# Altium project stm32_board.PrjPcb
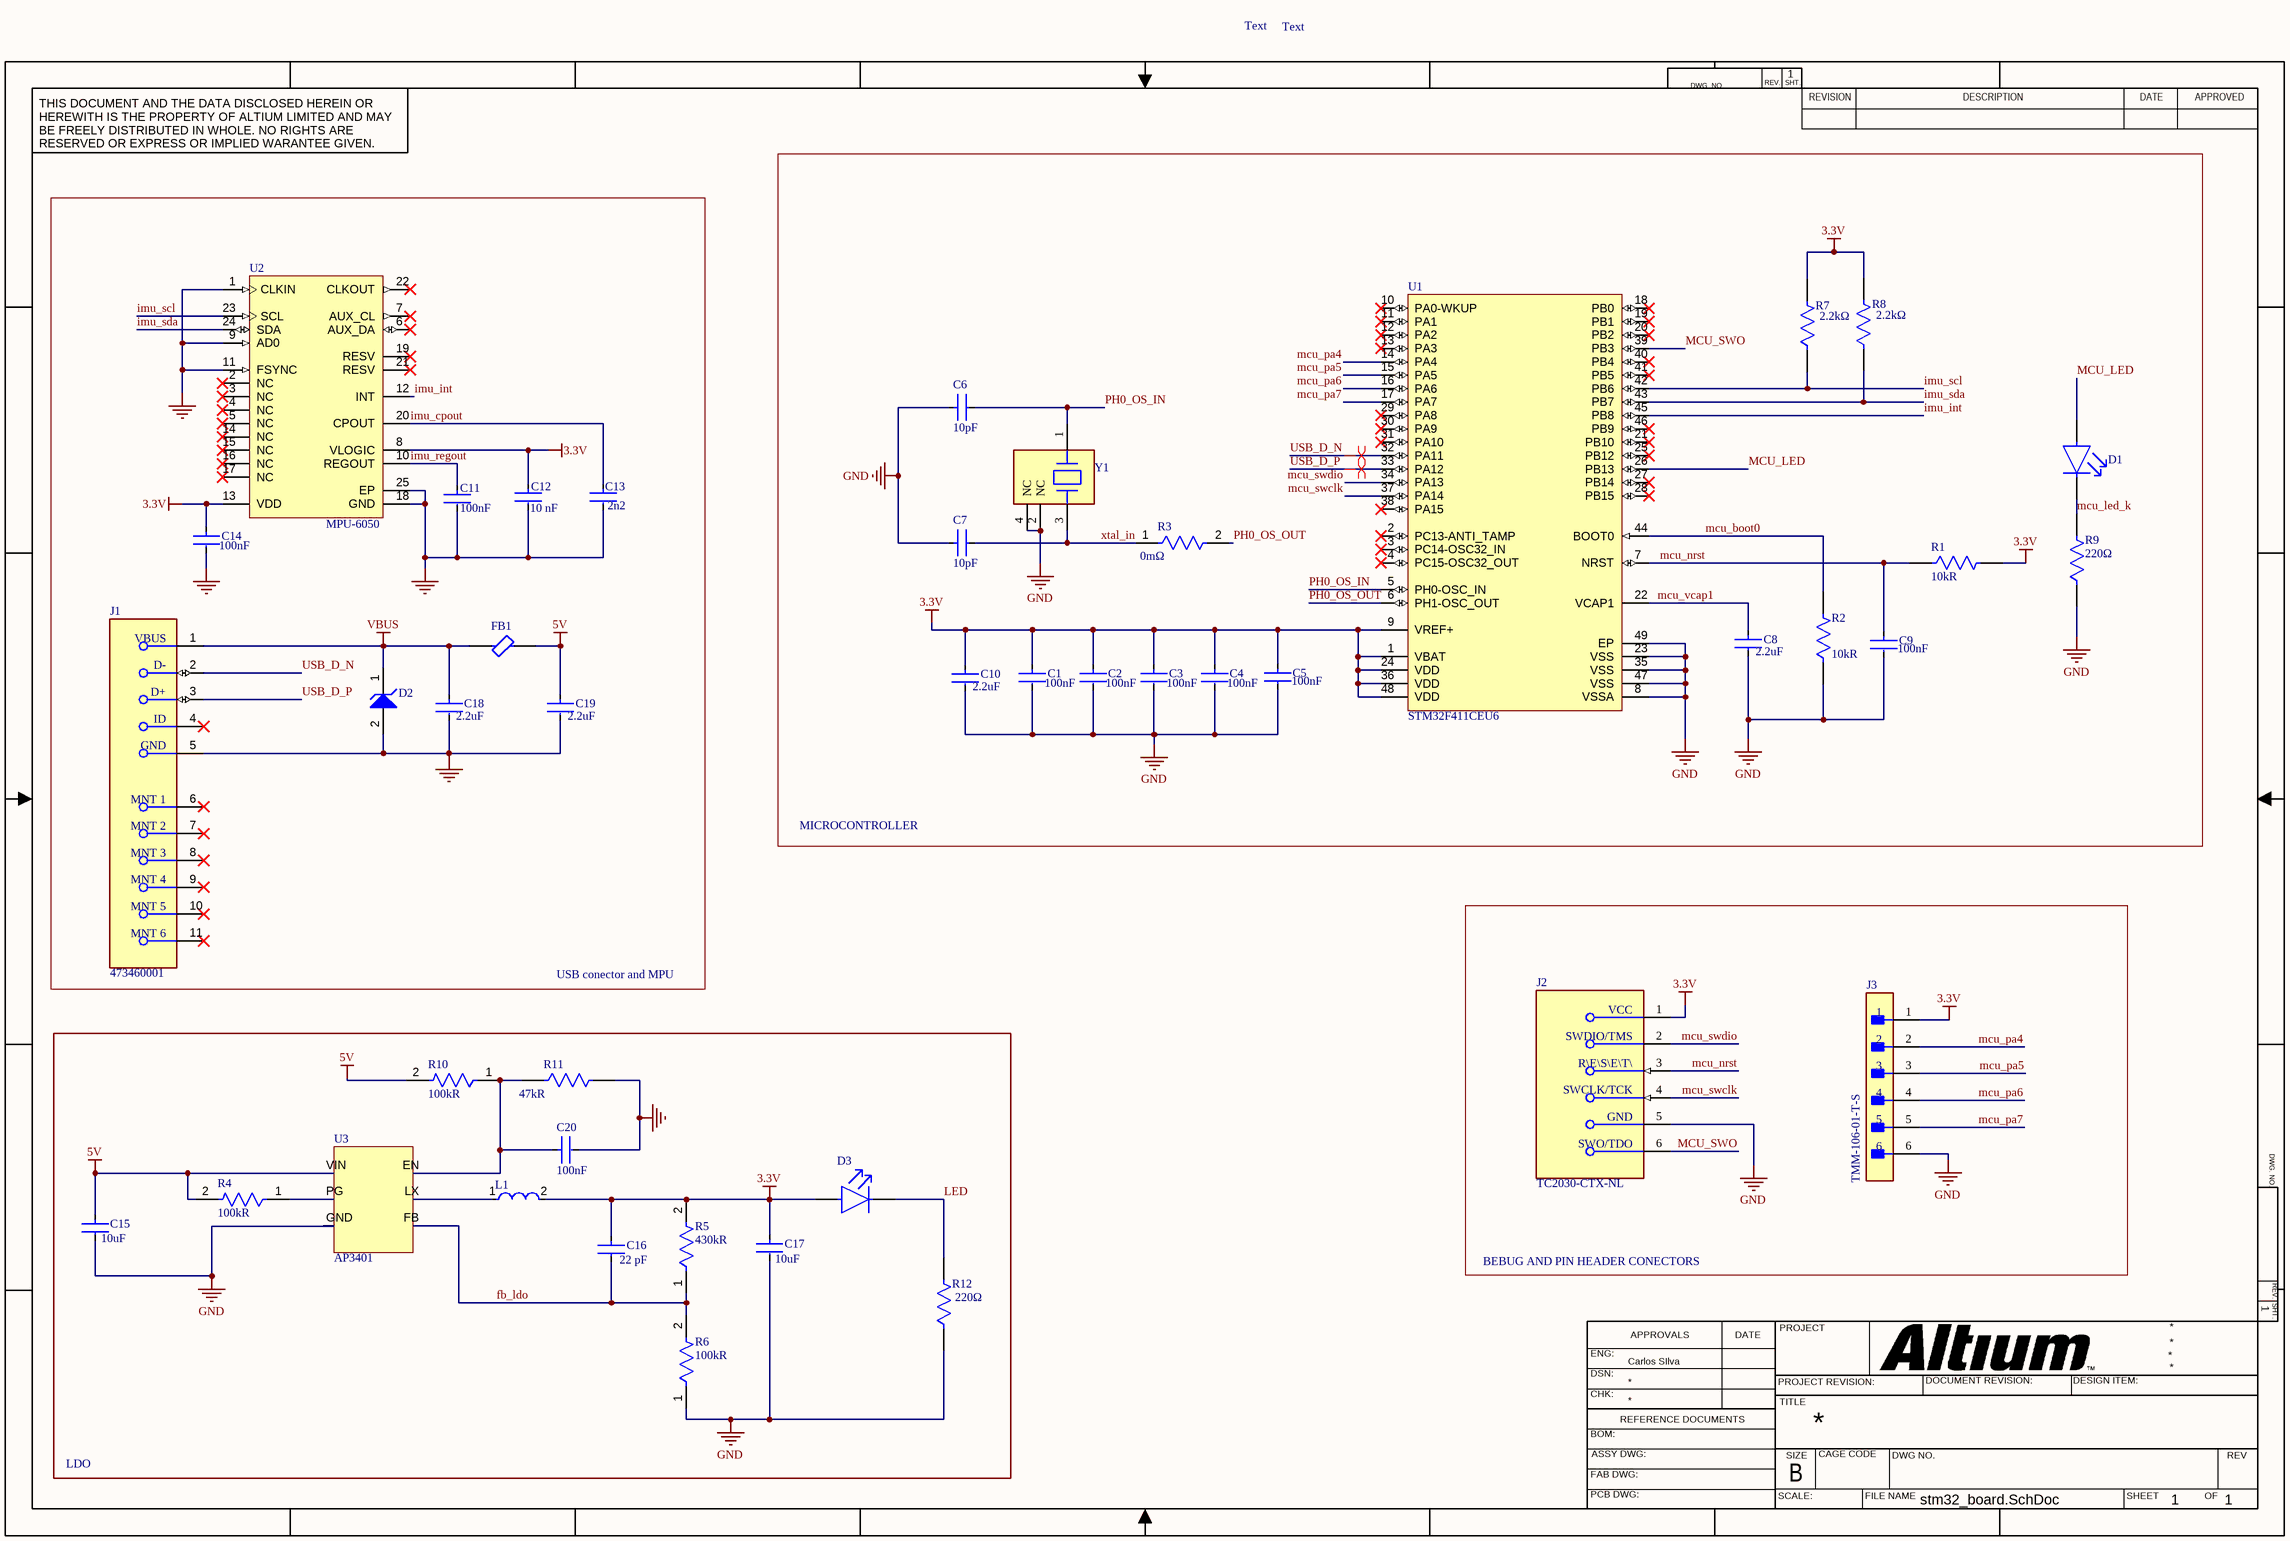
[diagram p0: stm32_board.SchDoc]
1 sheet, 44 parts. Net scope: global (net labels, ports and power ports of the same name join across sheets).
Board file: stm32_board.PcbDoc

## Sheet stm32_board.SchDoc
size 431 x 279 mm; Date: 20/07/25; Author: Phil's Lab/Carlos; CompanyName: Carclox; Engineer: Carlos SIlva; Organization: Carclox; DocumentNumber: 01; SheetNumber: 1; SheetTotal: 1

### Parts
C1  Capacitance: 100nF  [FP-CL17-IPC_C]  (hidden comment: CL05B104KP5NNNC)
C2  Capacitance: 100nF  [FP-CL17-IPC_C]  (hidden comment: CL05B104KP5NNNC)
C3  Capacitance: 100nF  [FP-CL17-IPC_C]  (hidden comment: CL05B104KP5NNNC)
C4  Capacitance: 100nF  [FP-CL17-IPC_C]  (hidden comment: CL05B104KP5NNNC)
C5  Capacitance: 100nF  [FP-CL17-IPC_C]  (hidden comment: CL05B104KP5NNNC)
C6  Capacitance: 10pF  [FP-GRM022-0_02-IPC_C]  (hidden comment: GRM0225C1C100JA03L)
C7  Capacitance: 10pF  [FP-GRM022-0_02-IPC_C]  (hidden comment: GRM0225C1C100JA03L)
C8  Capacitance: 2.2uF  [FP-GRM155-0_2-0_05-IPC_A]  (hidden comment: GRM155D71A225ME15D)
C9  Capacitance: 100nF  [FP-CL17-IPC_C]  (hidden comment: CL05B104KP5NNNC)
C10  Capacitance: 2.2uF  [FP-GRM155-0_2-0_05-IPC_A]  (hidden comment: GRM155D71A225ME15D)
C11  Capacitance: 100nF  [FP-CL17-IPC_C]  (hidden comment: CL05B104KP5NNNC)
C12  Capacitance: 10 nF  [FP-C0603C-CF-MFG]  (hidden comment: C0603C103K5RACTU)
C13  value 2n2  [FP-C0402-BB-MFG]  (hidden comment: C0402C222F4GACTU)
C14  Capacitance: 100nF  [FP-CL17-IPC_C]  (hidden comment: CL05B104KP5NNNC)
C15  Capacitance: 10uF  [FP-0603-L_1_6_0_2-W_0_8_0-IPC_A]  (hidden comment: LMK107BBJ106MALT)
C16  Capacitance: 22 pF  [FP-C0603C-CF-MFG]  (hidden comment: C0603C220J5GACTU)
C17  Capacitance: 10uF  [FP-0603-L_1_6_0_2-W_0_8_0-IPC_A]  (hidden comment: LMK107BBJ106MALT)
C18  Capacitance: 2.2uF  [FP-GRM155-0_2-0_05-IPC_A]  (hidden comment: GRM155D71A225ME15D)
C19  Capacitance: 2.2uF  [FP-GRM155-0_2-0_05-IPC_A]  (hidden comment: GRM155D71A225ME15D)
C20  Capacitance: 100nF  [FP-CL17-IPC_C]  (hidden comment: CL05B104KP5NNNC)
D1  LTST-C190GKT  [FP-LTST-C190GKT-MFG]  (value not drawn)
D2  ESD9X5.0ST5G  [ONSC-SOD-923-2-514AA-01_V]  (value not drawn)
D3  LTST-C190GKT  [FP-LTST-C190GKT-MFG]  (value not drawn)
FB1  BLM18KG121TN1D  [FP-BLM18-0_15-t0_6-d1_2-IPC_A]  (value not drawn)
J1  473460001  [FP-473460001-MFG]
J2  TC2030-CTX-NL  [FP-TC2030-CTX-NL-MFG]
J3  TMM-106-01-T-S  [FP-TMM-106-01-T-S-MFG]
L1  LQM2MPN2R2NG0L  [FP-LQM2MPN_G0-MFG]  (value not drawn)
R1  Resistance: 10kR  [FP-RMCF0603-MFG]  (hidden comment: RMCF0603FT10K0)
R2  Resistance: 10kR  [FP-RMCF0603-MFG]  (hidden comment: RMCF0603FT10K0)
R3  Resistance: 0mΩ  [FP-RMCF0603-MFG]  (hidden comment: RMCF0603ZT0R00)
R4  Resistance: 100kR  [FP-RMCF0603-IPC_C]  (hidden comment: RMCF0603FT100K)
R5  Resistance: 430kR  [FP-KTR25-MFG]  (hidden comment: KTR25JZPF4303)
R6  Resistance: 100kR  [FP-RMCF0603-IPC_C]  (hidden comment: RMCF0603FT100K)
R7  value 2.2kΩ  [FP-ERA2A-MFG]  (hidden comment: ERA-2AEB222X)
R8  value 2.2kΩ  [FP-ERA2A-MFG]  (hidden comment: ERA-2AEB222X)
R9  Resistance: 220Ω  [FP-CRGCQ0402-IPC_C]  (hidden comment: CRGCQ0402J220R)
R10  Resistance: 100kR  [FP-RMCF0603-IPC_C]  (hidden comment: RMCF0603FT100K)
R11  Resistance: 47kR  [FP-RC0603FR-0747KL-MFG]  (hidden comment: RC0603FR-0747KL)
R12  Resistance: 220Ω  [FP-CRGCQ0402-IPC_C]  (hidden comment: CRGCQ0402J220R)
U1  STM32F411CEU6  [STM-UFQFPN48_L]
U2  MPU-6050  [IS-QFN-24_V]
U3  AP3401  [AP3401]
Y1  XRCGB24M000F3M00R0  [FP-XRCGB_F_N-MFG]  (value not drawn)

### Blocks framed on the sheet
MICROCONTROLLER: C1-C10 D1 R1-R3 R7-R9 U1 Y1
USB conector and MPU: C11-C14 C18 C19 D2 FB1 J1 U2
BEBUG AND PIN HEADER CONECTORS: J2 J3
LDO: C15-C17 C20 D3 L1 R4-R6 R10-R12 U3

### Nets
3.3V: C1.1 C2.1 C3.1 C4.1 C5.1 C10.1 C12.1 C14.1 C16.1 C17.1 D3.2(A) J2.1(VCC) J3.1 L1.2 R1.2 R5.2 R7.2 R8.2 U1.1(VBAT) U1.9(VREF+) U1.24(VDD) U1.36(VDD) U1.48(VDD) U2.8(VLOGIC) U2.13(VDD)
5V: C15.1 C19.1 FB1.2 R4.2 R10.2 U3.VIN
GND: C1.2 C2.2 C3.2 C4.2 C5.2 C6.1 C7.1 C8.2 C9.2 C10.2 C11.2 C12.2 C13.2 C14.2 C15.2 C17.2 C18.2 C19.2 C20.2 D2.2(A) J1.5(GND) J2.5(GND) J3.6 R2.1 R6.1 R9.1 R11.2 R12.1 U1.8(VSSA) U1.23(VSS) U1.35(VSS) U1.47(VSS) U1.49(EP) U2.1(CLKIN) U2.9(AD0) U2.11(FSYNC) U2.18(GND) U2.25(EP) U3.GND Y1.2(NC) Y1.4(NC)
VBUS: C18.1 D2.1(K) FB1.1 J1.1(VBUS)
fb_ldo: C16.2 R5.1 R6.2 U3.FB
imu_cpout: C13.1 U2.20(CPOUT)
imu_int: U1.45(PB8) U2.12(INT)
imu_regout: C11.1 U2.10(REGOUT)
imu_scl: R7.1 U1.42(PB6) U2.23(SCL)
imu_sda: R8.1 U1.43(PB7) U2.24(SDA)
LED: D3.1(C) R12.2
mcu_boot0: R2.2 U1.44(BOOT0)
MCU_LED: D1.2(A) U1.26(PB13)
mcu_led_k: D1.1(C) R9.2
mcu_nrst: C9.1 J2.3(~{RESET}) R1.1 U1.7(NRST)
mcu_pa4: J3.2 U1.14(PA4)
mcu_pa5: J3.3 U1.15(PA5)
mcu_pa6: J3.4 U1.16(PA6)
mcu_pa7: J3.5 U1.17(PA7)
mcu_swclk: J2.4(SWCLK/TCK) U1.37(PA14)
mcu_swdio: J2.2(SWDIO/TMS) U1.34(PA13)
MCU_SWO: J2.6(SWO/TDO) U1.39(PB3)
mcu_vcap1: C8.1 U1.22(VCAP1)
PH0_OS_IN: C6.2 U1.5(PH0-OSC_IN) Y1.1(1_Input/Output)
PH0_OS_OUT: R3.2 U1.6(PH1-OSC_OUT)
USB_D_N: J1.2(D-) U1.32(PA11)
USB_D_P: J1.3(D+) U1.33(PA12)
xtal_in: C7.2 R3.1 Y1.3(2_Input/Output)
NetC20_1: C20.1 R10.1 R11.1 U3.EN
NetL1_1: L1.1 U3.LX
NetR4_1: R4.1 U3.PG

Not connected (* = marked no-connect by the designer): J1 4(ID)* 6(MNT_1)* 7(MNT_2)* 8(MNT_3)* 9(MNT_4)* 10(MNT_5)* 11(MNT_6)*; U1 2(PC13-ANTI_TAMP)* 3(PC14-OSC32_IN)* 4(PC15-OSC32_OUT)* 10(PA0-WKUP)* 11(PA1)* 12(PA2)* 13(PA3)* 18(PB0)* 19(PB1)* 20(PB2)* 21(PB10)* 25(PB12)* 27(PB14)* 28(PB15)* 29(PA8)* 30(PA9)* 31(PA10)* 38(PA15)* 40(PB4)* 41(PB5)* 46(PB9)*; U2 2(NC)* 3(NC)* 4(NC)* 5(NC)* 6(AUX_DA)* 7(AUX_CL)* 14(NC)* 15(NC)* 16(NC)* 17(NC)* 19(RESV)* 21(RESV)* 22(CLKOUT)*

### Layout directives
differential pair: USB_D_N, USB_D_P

### Notes on the sheet
- Text
- DWG. NO.
- REV.
- SHT.
- THIS DOCUMENT AND THE DATA DISCLOSED HEREIN OR HEREWITH IS THE PROPERTY OF ALTIUM LIMITED AND MAY BE FREELY DISTRIBUTED IN WHOLE. NO RIGHTS ARE RESERVED OR EXPRESS OR IMPLIED WARANTEE GIVEN.
- REVISION
- DESCRIPTION
- DATE
- APPROVED
- ENG:
- APPROVALS
- PROJECT
- DSN:
- CHK:
- REFERENCE DOCUMENTS
- PROJECT REVISION:
- TITLE
- DOCUMENT REVISION:
- DESIGN ITEM:
- BOM:
- FAB DWG:
- PCB DWG:
- ASSY DWG:
- SCALE:
- SIZE
- B
- CAGE CODE
- FILE NAME
- DWG NO.
- SHEET
- OF
- REV

### Library data of the parts
C1-C5 C9 C11 C14 C20 = CMP-13271-001069-1: Cap Ceramic 100nF 10V X7R ±10% SMD 0402 +125°C Paper T/R; Height: 0.5mm; Case/Package: 0402; Contact Plating: Tin; Case Code (Imperial): 0402; Thickness: 0.022inch; Min Operating Temperature: -55°C; Package Quantity: 1; Length: 1mm; Max Operating Temperature: 125°C; Depth: 0.5mm; Voltage Rating: 10V; Packaging: Tape and Reel; Mount: Surface Mount; Tolerance: 10%; Width: 0.02inch; Radiation Hardening: No; Case Code (Metric): 1005; Dielectric: X7R
C6 C7 = CMP-06035-032745-1: Chip Multilayer Ceramic Capacitors for General Purpose, 01005, 10pF, C0G, 30ppm/°C, 5%, 16V; Max Operating Temperature: 125°C; Width: 0.008inch; Packaging: Cut Tape; Case Code (Imperial): 1005; Thickness: 0.009inch; Voltage Rating: 16V; Case Code (Metric): 0402; Tolerance: 5%; Mount: Surface Mount; Length: 0.016inch; Min Operating Temperature: -55°C; Dielectric: C0G; Voltage Rating (DC): 16V
C8 C10 C18 C19 = CMP-06035-053899-1: Chip Multilayer Ceramic Capacitors for General Purpose, 0402, 2.2uF, X7T, +22%/-33%, 20%, 10V; Voltage Rating (DC): 10V; Height: 0.5mm; Voltage Rating: 10V; Tolerance: 20%; Termination: SMD/SMT; Case/Package: 0402; Packaging: Tape and Reel; Dielectric: X7T; Case Code (Metric): 1005; Width: 0.02inch; Length: 0.039inch; Weight: 0.000212oz; Max Operating Temperature: 125°C; Min Operating Temperature: -55°C; Mount: Surface Mount; Thickness: 0.022inch; Case Code (Imperial): 0402; Package Quantity: 10000
C12 = CMP-2006-03046-3: CAP CER 10000PF 50V X7R 0603; Manufacturer: KEMET; Temperature Coefficient: 30ppm/°C; Automotive Grade: Grade 1; Material: Ceramic; Value: 10,000 pF; Tolerance: 0.1; Voltage Rating: 50 V; Digikey Description: CAP CER 10000PF 50V X7R 0603; ComponentLink2Description: Datasheet; Mouser Description: Ceramic Capacitor 0.01Uf, 50V, X7R, 10%, 0603, Full Reel; ComponentLink2URL: https://api.kemet.com/component-edge/download/datasheet/C0603C100J5GACAUTO.pdf; Package: C0603C-CF; RoHS: TRUE; Octopart: https://octopart.com/c0603c103k5ractu-kemet-133094; Device Class L1: Passive Components; Manufacturer Part Number: C0603C103K5RACTU; Temperature Range Low: -55°C; Automotive: Yes; Category: Cap; Lead Free: Yes; Temperature: -55°C to +125°C; Temperature Range High: +125°C; Temperature Characteristic: X7R; Height: 0.87mm; Device Class L3: Ceramic Capacitors; Device Class L2: Capacitors
C13 = CMP-1034-01730-4: CAP CER 2200PF 16V NP0 0402; Manufacturer: Kemet; Temperature Coefficient: 15%; Capacitance: 2,200 pF; Material: Ceramic; Temperature Characteristic: C0G; Tolerance: 0.01; Lead Free: Yes; Voltage Rating: 16 V; Octopart: https://octopart.com/c0402c222f4gactu-kemet-12823119; Mouser Description: Cap Ceramic 0.0022uF 16V C0G 1% SMD 0402 125°C Punched Paper T/R; Temperature Range Low: -55°C; Ipc Land Pattern Name: CAPC10050X50; Digikey Description: CAP CER 2200PF 16V NP0 0402; Temperature Range High: +125°C; Manufacturer Part Number: C0402C222F4GACTU; Package: C0402-BB; ComponentLink2URL: https://content.kemet.com/datasheets/KEM_C1002_X7R_SMD.pdf; ComponentLink2Description: Datasheet; Device Class L3: Ceramic Capacitors; Device Class L1: Passive Components; Category: Cap; Height: 0.55mm; Device Class L2: Capacitors; Automotive: No; Temperature: -55°C to +125°C; RoHS: TRUE
C15 C17 = CMP-14477-000150-3: Multilayer Ceramic Capacitor 10uF 10V X5R 20% SMD 0603 T/R; Voltage: 10V; Thickness: 0.035inch; Case/Package: 0603; Voltage Rating: 10V; Lead Free: Lead Free; Depth: 0.8mm; Tolerance: 20%; Mount: Surface Mount; Package Quantity: 1; Construction: Flat; Packaging: Tape and Reel; Series: M; Height: 0.8mm; Case Code (Metric): 1608; Voltage Rating (DC): 10V; RoHS Compliant: Yes; Case Code (Imperial): 0603; Length: 1.6mm; Dielectric: X5R; Radiation Hardening: No; Resistor Type: Ceramic; Min Operating Temperature: -55°C; Termination: SMD/SMT; Width: 0.8mm; Max Operating Temperature: 85°C
C16 = CMP-2006-03119-3: Cap Ceramic 22pF 50V C0G 5% SMD 0603 125°C Paper T/R; Manufacturer: KEMET; Temperature Coefficient: 30ppm/°C; Automotive Grade: Grade 1; Tolerance: 0.05; RoHS: TRUE; Temperature Characteristic: C0G; Device Class L3: Ceramic Capacitors; Digikey Description: Cap Ceramic 22pF 50V C0G 5% SMD 0603 125°C Paper T/R; ComponentLink2URL: https://api.kemet.com/component-edge/download/datasheet/C0603C100J5GACAUTO.pdf; ComponentLink2Description: Datasheet; Automotive: Yes; Temperature: -55°C to +125°C; Temperature Range High: +125°C; Package: C0603C-CF; Device Class L1: Passive Components; Device Class L2: Capacitors; Lead Free: Yes; Value: 22 pF; Manufacturer Part Number: C0603C220J5GACTU; Category: Cap; Mouser Description: Cap Ceramic 22pF 50V C0G 5% SMD 0603 125°C Paper T/R; Voltage Rating: 50 V; Height: 0.87mm; Material: Ceramic; Temperature Range Low: -55°C; Octopart: https://octopart.com/c0603c220j5gactu-kemet-98525
D1 D3 = CMP-22017-000005-2: LED GREEN CLEAR CHIP SMD; Dominant Wavelength: 569nm; Reverse Voltage: 5V; Lens Color: Colorless; Viewing Angle: 130°; Voltage: 2V; Forward Current: 30mA; Power Dissipation: 100mW; Luminous Intensity: 6mcd; Number of LEDs: 1; Forward Voltage: 2.1V; Wavelength: 565nm; Test Current: 10mA; Min Operating Temperature: -55°C; Lens Style: Clear; Mount: Surface Mount; Width: 0.8mm; Packaging: Tape and Reel; Lens Transparency: Clear; Case Code (Metric): 1608; Depth: 0.8mm; Case Code (Imperial): 0603; Case/Package: 0603; Number of Pins: 2; Max Operating Temperature: 85°C; Lead Free: Lead Free; Number of Elements: 1; Length: 1.6mm; Height: 0.8mm; Package Quantity: 1; Power Rating: 100mW; Radiation Hardening: No; Illumination Color: Green; Color: Green
D2 = CMP-1063-00108-1: Transient Voltage Suppressor, Micro-Packaged Diode for ESD Protection, 2-Pin SOD-923, Pb-Free, Tape and Reel; Manufacturer: On Semiconductor; V(BR) Min (V): 6.2; VRWM Max (V): 5; Number of Lines: 1; Direction: Unidirectional; Mounting Technology: Surface Mount; PackageReference: SOD-923-2-514AA-01; RoHS: Pb-Free; PackageDescription: 2-Pin SOD, Body 0.8 x 0.6 mm; PartNumber: ESD9X5.0ST5G; IR Max (uA): 1; ComponentLink3Description: Package Specification; DatasheetVersion: Rev. 7; Packing: Tape and Reel; PackageVersion: Rev. E, 03/2011; ComponentLink3URL: http://www.onsemi.com/pub_link/Collateral/514AA.PDF; ComponentLink2Description: Datasheet; ComponentLink2URL: http://www.onsemi.cn/pub_link/Collateral/ESD9X3.3ST5G-D.PDF; ComponentLink1Description: Manufacturer URL; ComponentLink1URL: http://www.onsemi.com/
FB1 = CMP-0686-00554-8: FERRITE BEAD 120 OHM 0603 1LN; Max Current Rating: 3A; DC Resistance (DCR): 30mR; Impedance: 120R; Number of Lines: 1; Test Frequency: 100MHz; Tolerance: 25%; Package Quantity: 4000; Min Operating Temperature: -55°C; Termination: SMD/SMT; REACH SVHC: No SVHC; Core Material: Ferrite; Material: Ferrite; Current Rating: 3A; Height: 0.8mm; Number of Pins: 2; Case/Package: 0603; Case Code (Imperial): 0603; Series: BLM18K; Packaging: Tape and Reel; Inductor Type: FERRITE BEAD; Lead Free: Lead Free; Width: 0.8mm; Case Code (Metric): 1608; Number of Circuits: 1; Max DC Current: 3A; Depth: 0.95mm; Max Operating Temperature: 125°C; Length: 1.6mm; RoHS Compliant: Yes
J1 = CMP-2000-05246-2: CONN RCPT USB2.0 MICRO B SMD R/A; Manufacturer: Molex; Conn Orientation: Right Angle; Is Female: yes; Shielding: true; Pitch: 0.65mm; Number Of Contacts: 5; Voltage Rating: 30V; Current Rating: 1.8A; Device Class L2: USB Connectors; Digikey Description: CONN RCPT USB2.0 MICRO B SMD R/A; Height: 2.945mm; RoHS: TRUE; ComponentLink2Description: Datasheet; Octopart: https://octopart.com/47346-0001-molex-7164928; Automotive: No; Package: 0; Category: Conn; Device Class L1: Connectors; Usb Standard: USB 2.0; Temperature: -30°C to +85°C; Temperature Range Low: -30°C; Footprint Url: https://www.molex.com/pdm_docs/sd/473460001_sd.pdf; ComponentLink2URL: https://www.molex.com/webdocs/datasheets/pdf/en-us/0473460001_IO_CONNECTORS.pdf; Lead Free: Yes; Manufacturer Part Number: 473460001; Contact Material: Gold,Nickel; Temperature Range High: +85°C; Device Class L3: unset
J2 = CMP-205963-000001-1: 6-Pin “No legs” TC2030 Plug-of-Nails™ Cable for use with ARM Cortex processors
J3 = CMP-02766-001694-1: CONN HEADER VERT 6POS 2MM; Gender: Male; Max Voltage Rating (AC): 500V; Number of Contacts: 6; Connector Type: Male Pin; Housing Material: Polymer; Max Operating Temperature: 105°C; Termination: Solder; Radiation Hardening: No; Packaging: Bulk; Color: Black; Width: 1.97mm; Housing Color: Black; Lead Free: Lead Free; Depth: 1.97mm; Pitch: 2mm; Length: 12mm; Contact Plating: Tin; Series: FleXYZ™ TMM; Contact Mating Length: 0.126inch; RoHS Compliant: Yes; Contact Material: Bronze; Number of Rows: 1; Min Operating Temperature: -55°C; Mount: Through Hole; Orientation: Straight; Contact Type: Male Pin; Number of Positions: 6; REACH SVHC: No SVHC
L1 = CMP-06042-016770-1: Multilayer Type Inductor for Power Lines, 0806 (2016), 2.2μH, 30%, 0.138Ω, 1.2A; Shielding: Shielded; Inductance: 2.2uH; Test Frequency: 1MHz; DC Resistance (DCR): 138mR; Core Material: Ferrite; Self Resonant Frequency: 40MHz; Packaging: Tape and Reel; Mount: Surface Mount; Package Quantity: 1; Case Code (Imperial): 0806; Width: 0.063inch; DC Current: 1.2A; Min Operating Temperature: -55°C; Radiation Hardening: No; Tolerance: 30%; RoHS Compliant: Yes; Case/Package: 0806; Lead Free: Lead Free; Height - Seated (Max): 0.039inch; Max Operating Temperature: 125°C; Series: LQM2MPN_G0; Height: 1mm; Inductance Tolerance: 30%; Length: 0.079inch; Case Code (Metric): 2016; Military Standard: Not; Depth: 1.75mm; Termination: SMD/SMT; Max DC Current: 1.2A; REACH SVHC: No SVHC; Current Rating: 1.2A
R1 R2 = CMP-2000-06990-2: 10kΩ ±1% 0.1W 0603 Thick Film Chip Resistor AEC-Q200 compliant; Max Power Dissipation: 100mW; Temperature Coefficient: 100ppm/°C; Military Standard: Not; Mount: Surface Mount; Depth: 0.8mm; Height: 0.022inch; Size Code: 0603; Case/Package: 0603; Resistor Type: Thick Film; Min Operating Temperature: -55°C; Length: 1.55mm; Construction: Rectangular; Case Code (Imperial): 0603; Packaging: Tape and Reel; Radiation Hardening: No; Power Rating: 100mW; Max Operating Temperature: 155°C; Contact Plating: Tin; Case Code (Metric): 1608; Lead Free: Lead Free; Series: RMCF; Tolerance: 1%; Features: Automotive AEC-Q200; Number of Terminations: 2; RoHS Compliant: Yes; Width: 0.031inch
R3 = CMP-26527-000011-1: RES 0 OHM JUMPER 1/10W 0603; Manufacturer: Stackpole; Power Rating: 0.1W; Voltage Rating: 75V; Automotive Grade: Grade 0; Value: 0mΩ; Series: RMCF; Manufacturer Part Number: RMCF0603ZT0R00; Device Class L1: Passive Components; Device Class L3: Chip SMD Resistors; Octopart: https://octopart.com/rmcf0603zt0r00-stackpole+electronics-19213618; Temperature: -55°C to +155°C; Lead Free: Yes; ComponentLink2URL: https://www.seielect.com/catalog/sei-rmcf_rmcp.pdf; Height: 0.55mm; Composition: Thick Film; Package: RMCF0603; Automotive: Yes; Temperature Range High: +155°C; Ipc Land Pattern Name: RESC15580X45; Digikey Description: RES 0 OHM JUMPER 1/10W 0603; RoHS: TRUE; ComponentLink2Description: Datasheet; Temperature Range Low: -55°C; Category: Res; Device Class L2: Resistors
R4 R6 R10 = CMP-2000-06989-2: 100kΩ ±1% 0.1W 0603 Thick Film Chip Resistor AEC-Q200 compliant; Working Voltage: 75V; Max Power Dissipation: 100mW; Temperature Coefficient: 100ppm/°C; Height: 0.022inch; Construction: Rectangular; Lead Free: Lead Free; Tolerance: 1%; Features: Automotive AEC-Q200; Packaging: Tape and Reel; Number of Terminations: 2; Mount: Surface Mount; Case Code (Imperial): 0603; Case/Package: 0603; Resistor Type: Thick Film; Radiation Hardening: No; Power Rating: 100mW; Max Operating Temperature: 155°C; Length: 1.55mm; Width: 0.031inch; Military Standard: Not; RoHS Compliant: Yes; Min Operating Temperature: -55°C; Series: RMCF; Depth: 0.8mm; Case Code (Metric): 1608; Contact Plating: Tin
R5 = CMP-08839-003750-1: Res Thick Film 1210 430kΩ 1% 0.1W ±100ppm/°C Automotive Embossed T/R; Max Power Dissipation: 333mW; Packaging: Tape and Reel; Height: 0.028inch; Case/Package: 1210; Case Code (Metric): 3225; Series: KTR; Length: 0.126inch; RoHS Compliant: Yes; Width: 0.098inch; Number of Terminations: 2; Temperature Coefficient: 100ppm/°C; Case Code (Imperial): 1210; Resistor Type: Thick Film; Max Operating Temperature: 155°C; Min Operating Temperature: -55°C; Package Quantity: 4000; Tolerance: 1%; Features: Automotive AEC-Q200
R7 R8 = CMP-2002-05881-2: RES SMD 2.2K OHM 0.1% 1/16W 0402; Manufacturer: Panasonic; Temperature Coefficient: 25ppm/°C; Power Rating: 0.063W; Voltage Rating: 50V; Automotive Grade: Grade 0; Automotive: Yes; Device Class L1: Passive Components; Tolerance: 0.1%; Digikey Description: RES SMD 2.2K OHM 0.1% 1/16W 0402; Device Class L2: Resistors; Manufacturer Part Number: ERA-2AEB222X; Octopart: https://octopart.com/era-2aeb222x-panasonic-9251391; ComponentLink2Description: Datasheet; Ipc Land Pattern Name: RESC10050X35; Package: ERA2A; Height: 0.4mm; ComponentLink2URL: https://industrial.panasonic.com/cdbs/www-data/pdf/RDM0000/AOA0000C307.pdf; Temperature Range High: +155°C; Device Class L3: Chip SMD Resistors; Temperature Range Low: -55°C; Lead Free: Yes; Mouser Description: Thin Film Resistors - SMD 0402 1/16W 2.2Kohms; Footprint Url: https://b2b-api.panasonic.eu/file_stream/pids/fileversion/1079; Temperature: -55°C to +155°C; Category: Res; Resistance: 2.2kΩ; Composition: Metal Film; Series: E24; RoHS: TRUE
R9 R12 = CMP-03211-000793-1: CRGCQ 0402 220R 5%; Manufacturer: TE Connectivity; Power Rating: 0.0625W; Tolerance: 0.05; Temperature Coefficient: ±100ppm/°C; Voltage Rating: 50V; Value: 220Ω; RoHS: TRUE; Category: Res; Series: CRGCQ; Manufacturer Part Number: CRGCQ0402J220R; Composition: Thick Film; Lead Free: Yes; Temperature Range Low: -55°C; Digikey Description: CRGCQ 0402 220R 5%; Package: CRGCQ0402; Device Class L2: Resistors; Ambient Temperature Range High: +70°C; Automotive: Yes; Device Class L3: Chip SMD Resistors; Device Class L1: Passive Components; Height: 0.4mm; ComponentLink2URL: https://www.te.com/commerce/DocumentDelivery/DDEController?Action=showdoc&DocId=Data+Sheet%7F1773204-3%7F1%7Fpdf%7FEnglish%7FENG_DS_1773204-3_1.pdf%7F4-2176347-539; ComponentLink2Description: Datasheet; Octopart: https://octopart.com/crgcq0402j220r-te+connectivity-91018007; Temperature Range High: +155°C; Ipc Land Pattern Name: RESC10050X35; Temperature: -55°C to +155°C
R11 = CMP-1659-00055-2: RES SMD 47K OHM 1% 1/10W 0603; Voltage Rating: 50V; Temperature Coefficient: 100ppm/°C; Max Power Dissipation: 100mW; Voltage Rating (DC): 50V; Min Operating Temperature: -55°C; Packaging: Tape and Reel; Features: Moisture Resistant; Termination: SMD/SMT; Technology: THICK FILM; Lead Free: Lead Free; Max Operating Temperature: 155°C; Width: 0.031inch; Case Code (Metric): 1608; Tolerance: 1%; Package Quantity: 1; Resistor Type: Thick Film; RoHS Compliant: Yes; Case/Package: 0603; Case Code (Imperial): 0603; Resistance Tolerance: 1%; Length: 0.063inch; Series: RC; Number of Pins: 2; Power Rating: 100mW; Number of Terminations: 2; Construction: Rectangular; Height: 0.022inch; Military Standard: Not; Size Code: 0603; Depth: 0.8mm
U1 = CMP-0243-00165-1: ARM Cortex-M4 32-bit MCU+FPU, 512 KB Flash, 128 KB RAM, 36 I/Os, 48-Pin UFQFPN, -40 to 85 degC, Tray; Operating Frequency(F) (Processor speed) (MHz): 100; FLASH Size (Prog) (kB): 512; Internal RAM Size (kB): 128; I/Os (High Current): 36; Supply Voltage(Vcc) min (V): 1.7; Package Reference: 48-Pin Ultra Thin Fine Pitch Quad Flat No-Lead, 7 x 7 x 0.6 mm Body, 0.5 mm Pitch, Exposed Pad; ComponentLink1Description: Manufacturer URL; ComponentLink1URL: http://www.st.com/; Packing: Tray; Package Description: UFQFPN48; Core: ARM Cortex-M4; ComponentLink2Description: Datasheet; ComponentLink2URL: http://www.st.com/st-web-ui/static/active/en/resource/technical/document/datasheet/DM00115249.pdf; DatasheetVersion: Rev. 6; Mounting Technology: Surface Mount
U2 = CMP-1753-00002-2: 3-Axis Gyroscope, Accelerometer and a Digital Motion Processor(TM) (DMP), 2.375 to 3.46 V, -40 to 85 degC, 24-Pin QFN, RoHS, Tape and Reel; Manufacturer: InvenSense; Featured Product: MPU-60506-Axis,IntegratedI²CSolution; Other Names: 1428-1007-2 / MPU6050; Sensor Type: MotionTracking; Online Catalog: MPU-6000™Series; Unit PriceUSD: Digital; Datasheet Version: Rev. 3.3, 05/2012; Category: Sensors,Transducers; Datasheet URL: http://datasheet.octopart.com/MPU-6050-InvenSense-datasheet-14421344.pdf; Family: Multifunction; Standard Package: 5,000; Manufacturer URL: http://www.invensense.com/; Output Type: Digital; Dynamic Catalog: MPU-6000™Series
U3 = AP3401: 1.5MHZ, 1A STEP-DOWN DC - DC BUCK CONVERTER; ComponentLink1Description: Datasheet; ComponentLink1URL: https://www.diodes.com/assets/Datasheets/AP3401.pdf
Y1 = CMP-06054-000017-1: CRYSTAL 24.0000MHZ 6PF SMD; ESR (Equivalent Series Resistance): 150R; Operating Frequency: 24 MHz; Tolerance: 30ppm; Frequency: 24MHz; Frequency Stability: 40ppm; Length: 2mm; Height: 0.028inch; Lead Free: Lead Free; Min Operating Temperature: -30°C; REACH SVHC: No SVHC; RoHS Compliant: Yes; Series Resistance: 150R; Mount: Surface Mount; Packaging: Tape and Reel; Termination: SMD/SMT; Case/Package: SMD/SMT; Max Operating Temperature: 85°C; Width: 1.6mm; Number of Pins: 4; Load Capacitance: 6pF; Package Quantity: 1; Depth: 1.6mm; Frequency Tolerance: 30ppm; Series: XRCGB